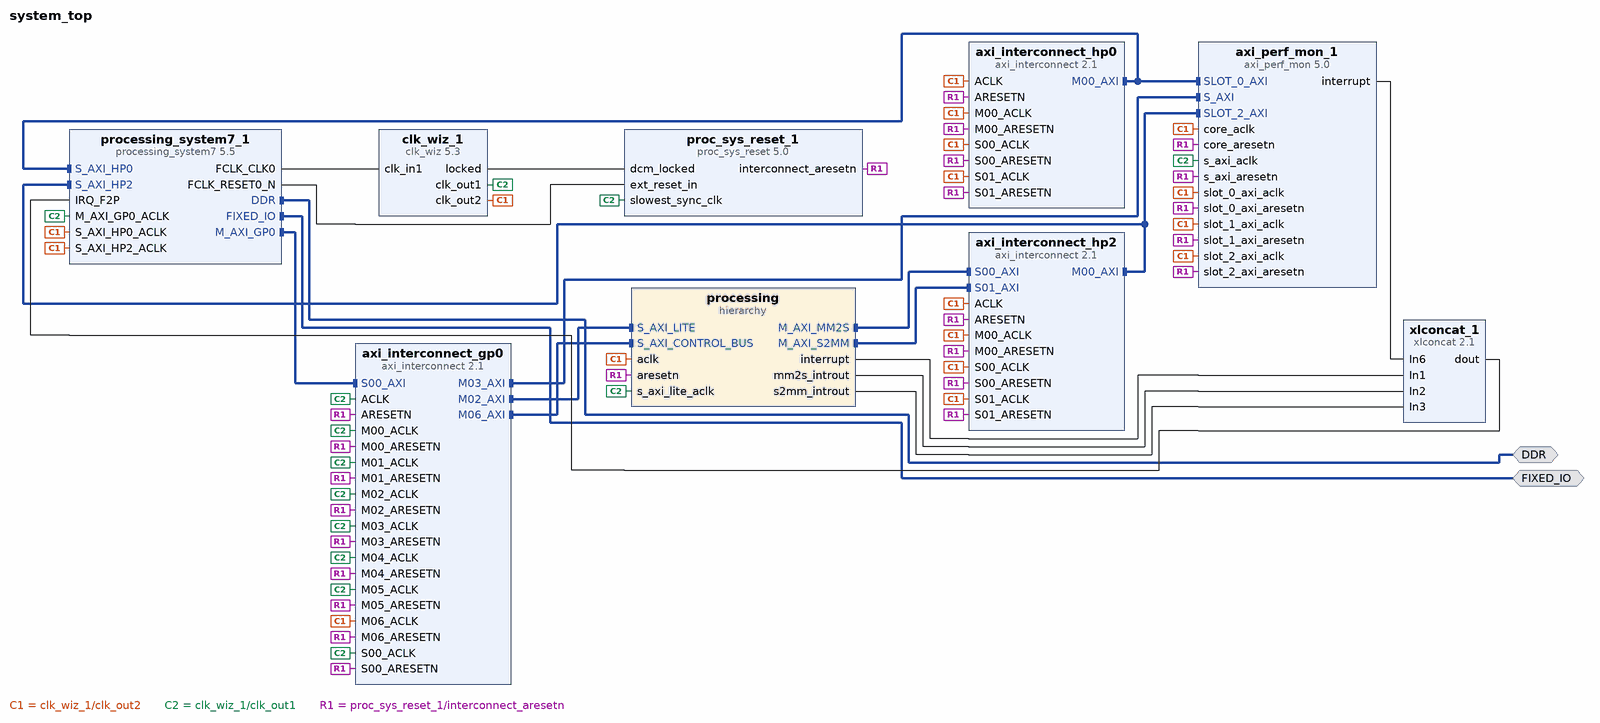
[diagram p0: block diagram of the top level]
# Vivado block design system_top, xc7z020clg484-1, Vivado 2016.3
create_bd_design system_top

create_bd_intf_port -mode Master -vlnv xilinx.com:interface:ddrx_rtl:1.0 DDR
create_bd_intf_port -mode Master -vlnv xilinx.com:display_processing_system7:fixedio_rtl:1.0 FIXED_IO

create_bd_cell -type ip -vlnv xilinx.com:ip:axi_interconnect:2.1 axi_interconnect_gp0
set_property -dict {CONFIG.NUM_MI 7 CONFIG.M06_HAS_REGSLICE 1} [get_bd_cells axi_interconnect_gp0]
create_bd_cell -type ip -vlnv xilinx.com:ip:axi_interconnect:2.1 axi_interconnect_hp0
set_property -dict [list \
  CONFIG.NUM_SI 2 \
  CONFIG.NUM_MI 1 \
  CONFIG.STRATEGY 2 \
  CONFIG.ENABLE_ADVANCED_OPTIONS 1 \
  CONFIG.M00_HAS_REGSLICE 1 \
  CONFIG.M00_HAS_DATA_FIFO 2 \
  CONFIG.S00_HAS_REGSLICE 1 \
  CONFIG.S01_HAS_REGSLICE 1 \
] [get_bd_cells axi_interconnect_hp0]
create_bd_cell -type ip -vlnv xilinx.com:ip:axi_interconnect:2.1 axi_interconnect_hp2
set_property -dict [list \
  CONFIG.NUM_SI 2 \
  CONFIG.NUM_MI 1 \
  CONFIG.STRATEGY 2 \
  CONFIG.ENABLE_ADVANCED_OPTIONS 1 \
  CONFIG.ENABLE_PROTOCOL_CHECKERS 0 \
  CONFIG.XBAR_DATA_WIDTH 64 \
  CONFIG.M00_HAS_REGSLICE 1 \
  CONFIG.M00_HAS_DATA_FIFO 2 \
  CONFIG.S00_HAS_REGSLICE 1 \
  CONFIG.S01_HAS_REGSLICE 1 \
] [get_bd_cells axi_interconnect_hp2]
create_bd_cell -type ip -vlnv xilinx.com:ip:axi_perf_mon:5.0 axi_perf_mon_1
set_property -dict [list \
  CONFIG.C_SLOT_3_AXI_PROTOCOL AXI3 \
  CONFIG.C_SLOT_2_AXI_PROTOCOL AXI3 \
  CONFIG.C_SLOT_1_AXI_PROTOCOL AXI3 \
  CONFIG.C_SLOT_0_AXI_PROTOCOL AXI3 \
  CONFIG.C_NUM_OF_COUNTERS 4 \
  CONFIG.C_NUM_MONITOR_SLOTS 3 \
  CONFIG.ENABLE_EXT_TRIGGERS 0 \
  CONFIG.C_ENABLE_PROFILE 1 \
] [get_bd_cells axi_perf_mon_1]
create_bd_cell -type ip -vlnv xilinx.com:ip:clk_wiz:5.3 clk_wiz_1
set_property -dict [list \
  CONFIG.USE_INCLK_SWITCHOVER false \
  CONFIG.CLKOUT2_USED true \
  CONFIG.NUM_OUT_CLKS 2 \
  CONFIG.CLKOUT1_REQUESTED_OUT_FREQ 50.000 \
  CONFIG.CLKOUT2_REQUESTED_OUT_FREQ 150.000 \
  CONFIG.PRIM_SOURCE No_buffer \
  CONFIG.USE_RESET false \
  CONFIG.CLKOUT1_JITTER 145.943 \
  CONFIG.CLKOUT1_PHASE_ERROR 94.994 \
  CONFIG.CLKOUT2_JITTER 116.798 \
  CONFIG.CLKOUT2_PHASE_ERROR 94.994 \
] [get_bd_cells clk_wiz_1]
create_bd_cell -type ip -vlnv xilinx.com:ip:proc_sys_reset:5.0 proc_sys_reset_1
set_property -dict {CONFIG.C_AUX_RESET_HIGH 0} [get_bd_cells proc_sys_reset_1]
create_bd_cell -type hier processing
create_bd_cell -type ip -vlnv xilinx.com:ip:processing_system7:5.5 processing_system7_1
set_property -dict [list \
  CONFIG.PCW_UIPARAM_DDR_FREQ_MHZ 533.333333 \
  CONFIG.PCW_APU_PERIPHERAL_FREQMHZ 666.666666 \
  CONFIG.PCW_SDIO_PERIPHERAL_FREQMHZ 50 \
  CONFIG.PCW_UART_PERIPHERAL_FREQMHZ 50 \
  CONFIG.PCW_I2C_PERIPHERAL_FREQMHZ 111.111115 \
  CONFIG.PCW_FPGA0_PERIPHERAL_FREQMHZ 100 \
  CONFIG.PCW_FPGA1_PERIPHERAL_FREQMHZ 50 \
  CONFIG.PCW_USE_S_AXI_HP0 1 \
  CONFIG.PCW_USE_S_AXI_HP2 1 \
  CONFIG.PCW_M_AXI_GP0_FREQMHZ 50 \
  CONFIG.PCW_S_AXI_HP0_FREQMHZ 150 \
  CONFIG.PCW_S_AXI_HP2_FREQMHZ 150 \
  CONFIG.PCW_USE_FABRIC_INTERRUPT 1 \
  CONFIG.PCW_GPIO_EMIO_GPIO_WIDTH 2 \
  CONFIG.PCW_IRQ_F2P_INTR 1 \
  CONFIG.PCW_IRQ_F2P_MODE REVERSE \
  CONFIG.PCW_PERIPHERAL_BOARD_PRESET part0 \
  CONFIG.PCW_PRESET_BANK0_VOLTAGE {LVCMOS 1.8V} \
  CONFIG.PCW_PRESET_BANK1_VOLTAGE {LVCMOS 1.8V} \
  CONFIG.PCW_UIPARAM_DDR_PARTNO {MT41J256M8 HX-15E} \
  CONFIG.PCW_QSPI_PERIPHERAL_ENABLE 1 \
  CONFIG.PCW_QSPI_QSPI_IO {MIO 1 .. 6} \
  CONFIG.PCW_QSPI_GRP_SINGLE_SS_ENABLE 1 \
  CONFIG.PCW_QSPI_GRP_SINGLE_SS_IO {MIO 1 .. 6} \
  CONFIG.PCW_QSPI_GRP_FBCLK_ENABLE 1 \
  CONFIG.PCW_QSPI_GRP_FBCLK_IO {MIO 8} \
  CONFIG.PCW_ENET0_PERIPHERAL_ENABLE 1 \
  CONFIG.PCW_ENET0_ENET0_IO {MIO 16 .. 27} \
  CONFIG.PCW_ENET0_GRP_MDIO_ENABLE 1 \
  CONFIG.PCW_ENET0_GRP_MDIO_IO {MIO 52 .. 53} \
  CONFIG.PCW_ENET_RESET_ENABLE 1 \
  CONFIG.PCW_ENET_RESET_SELECT {Share reset pin} \
  CONFIG.PCW_ENET0_RESET_ENABLE 1 \
  CONFIG.PCW_ENET0_RESET_IO {MIO 11} \
  CONFIG.PCW_SD0_PERIPHERAL_ENABLE 1 \
  CONFIG.PCW_SD0_SD0_IO {MIO 40 .. 45} \
  CONFIG.PCW_SD0_GRP_CD_ENABLE 1 \
  CONFIG.PCW_SD0_GRP_CD_IO {MIO 0} \
  CONFIG.PCW_SD0_GRP_WP_ENABLE 1 \
  CONFIG.PCW_SD0_GRP_WP_IO {MIO 15} \
  CONFIG.PCW_UART1_PERIPHERAL_ENABLE 1 \
  CONFIG.PCW_UART1_UART1_IO {MIO 48 .. 49} \
  CONFIG.PCW_TRACE_INTERNAL_WIDTH 32 \
  CONFIG.PCW_USB0_PERIPHERAL_ENABLE 1 \
  CONFIG.PCW_USB0_USB0_IO {MIO 28 .. 39} \
  CONFIG.PCW_USB_RESET_ENABLE 1 \
  CONFIG.PCW_USB_RESET_SELECT {Share reset pin} \
  CONFIG.PCW_USB0_RESET_ENABLE 1 \
  CONFIG.PCW_USB0_RESET_IO {MIO 7} \
  CONFIG.PCW_I2C0_PERIPHERAL_ENABLE 1 \
  CONFIG.PCW_I2C0_I2C0_IO {MIO 50 .. 51} \
  CONFIG.PCW_I2C0_GRP_INT_ENABLE 0 \
  CONFIG.PCW_I2C0_RESET_ENABLE 1 \
  CONFIG.PCW_I2C0_RESET_IO {MIO 13} \
  CONFIG.PCW_I2C1_PERIPHERAL_ENABLE 1 \
  CONFIG.PCW_I2C1_I2C1_IO EMIO \
  CONFIG.PCW_I2C_RESET_ENABLE 1 \
  CONFIG.PCW_I2C_RESET_SELECT {Share reset pin} \
  CONFIG.PCW_GPIO_MIO_GPIO_ENABLE 1 \
  CONFIG.PCW_GPIO_MIO_GPIO_IO MIO \
  CONFIG.PCW_GPIO_EMIO_GPIO_ENABLE 1 \
  CONFIG.PCW_GPIO_EMIO_GPIO_IO 2 \
  CONFIG.PCW_ENET0_PERIPHERAL_FREQMHZ {100 Mbps} \
  CONFIG.PCW_DCI_PERIPHERAL_CLKSRC 1 \
  CONFIG.PCW_PCAP_PERIPHERAL_CLKSRC 1 \
  CONFIG.preset ZC702 \
] [get_bd_cells processing_system7_1]
# 353 more settings of processing_system7_1 are not shown: defaults, MIO pin electricals, DDR timing, and values the tool derives
create_bd_cell -type ip -vlnv xilinx.com:ip:xlconcat:2.1 xlconcat_1
set_property -dict {CONFIG.NUM_PORTS 7} [get_bd_cells xlconcat_1]

# ---- hierarchy /processing ----
current_bd_instance /processing
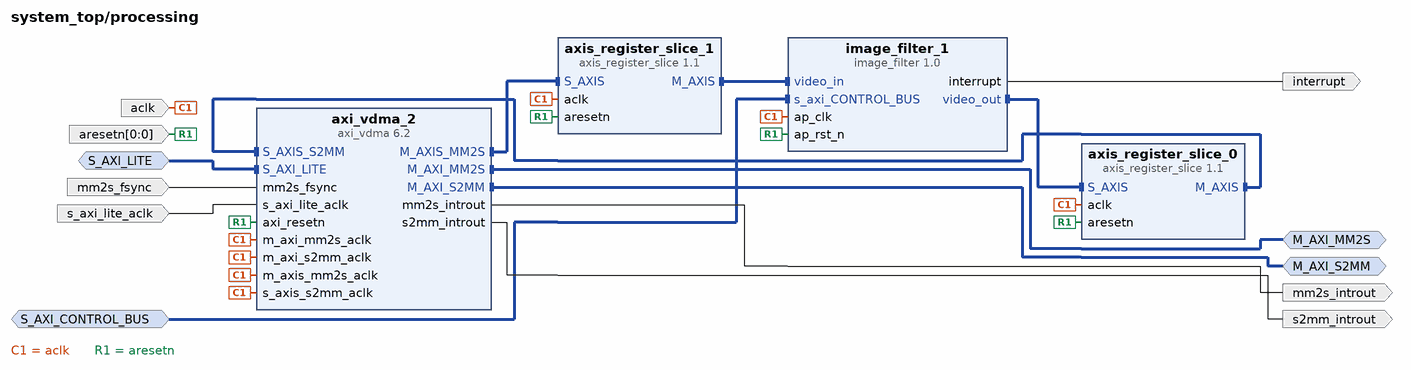
[diagram p1: block diagram inside /processing]
create_bd_intf_pin -mode Master -vlnv xilinx.com:interface:aximm_rtl:1.0 M_AXI_MM2S
create_bd_intf_pin -mode Master -vlnv xilinx.com:interface:aximm_rtl:1.0 M_AXI_S2MM
create_bd_intf_pin -mode Slave -vlnv xilinx.com:interface:aximm_rtl:1.0 S_AXI_CONTROL_BUS
create_bd_intf_pin -mode Slave -vlnv xilinx.com:interface:aximm_rtl:1.0 S_AXI_LITE
create_bd_pin -dir I -type clk aclk
create_bd_pin -dir I -from 0 -to 0 -type rst aresetn
create_bd_pin -dir O -type intr interrupt
create_bd_pin -dir I mm2s_fsync
create_bd_pin -dir O -type intr mm2s_introut
create_bd_pin -dir O -type intr s2mm_introut
create_bd_pin -dir I -type clk s_axi_lite_aclk

create_bd_cell -type ip -vlnv xilinx.com:ip:axi_vdma:6.2 axi_vdma_2
set_property -dict [list \
  CONFIG.c_m_axi_mm2s_data_width 32 \
  CONFIG.c_m_axis_mm2s_tdata_width 16 \
  CONFIG.c_m_axi_s2mm_data_width 32 \
  CONFIG.c_num_fstores 1 \
  CONFIG.c_use_mm2s_fsync 1 \
  CONFIG.c_use_s2mm_fsync 2 \
  CONFIG.c_mm2s_genlock_mode 3 \
  CONFIG.c_s2mm_genlock_mode 2 \
  CONFIG.c_mm2s_linebuffer_depth 4096 \
  CONFIG.c_s2mm_linebuffer_depth 4096 \
  CONFIG.c_mm2s_max_burst_length 16 \
  CONFIG.c_s2mm_max_burst_length 16 \
  CONFIG.c_enable_debug_info_7 1 \
  CONFIG.c_enable_debug_info_15 1 \
] [get_bd_cells axi_vdma_2]
create_bd_cell -type ip -vlnv xilinx.com:ip:axis_register_slice:1.1 axis_register_slice_0
create_bd_cell -type ip -vlnv xilinx.com:ip:axis_register_slice:1.1 axis_register_slice_1
create_bd_cell -type ip -vlnv xilinx.com:hls:image_filter:1.0 image_filter_1

# ---- connections ----

current_bd_instance /processing
connect_bd_intf_net [get_bd_intf_pins axi_vdma_2/M_AXIS_MM2S] [get_bd_intf_pins axis_register_slice_1/S_AXIS]
connect_bd_intf_net [get_bd_intf_pins axi_vdma_2/S_AXIS_S2MM] [get_bd_intf_pins axis_register_slice_0/M_AXIS]
connect_bd_intf_net [get_bd_intf_pins axis_register_slice_1/M_AXIS] [get_bd_intf_pins image_filter_1/video_in]
connect_bd_intf_net -intf_net image_filter_1_OUTPUT_STREAM [get_bd_intf_pins axis_register_slice_0/S_AXIS] [get_bd_intf_pins image_filter_1/video_out]
connect_bd_intf_net [get_bd_intf_pins M_AXI_MM2S] [get_bd_intf_pins axi_vdma_2/M_AXI_MM2S]
connect_bd_intf_net [get_bd_intf_pins M_AXI_S2MM] [get_bd_intf_pins axi_vdma_2/M_AXI_S2MM]
connect_bd_intf_net -intf_net axi_interconnect_gp0_M06_AXI [get_bd_intf_pins S_AXI_CONTROL_BUS] [get_bd_intf_pins image_filter_1/s_axi_CONTROL_BUS]
connect_bd_intf_net [get_bd_intf_pins S_AXI_LITE] [get_bd_intf_pins axi_vdma_2/S_AXI_LITE]
connect_bd_net [get_bd_pins axi_vdma_2/mm2s_introut] [get_bd_pins mm2s_introut]
connect_bd_net [get_bd_pins axi_vdma_2/s2mm_introut] [get_bd_pins s2mm_introut]
connect_bd_net -net clk_150mhz [get_bd_pins aclk] \
  [get_bd_pins axi_vdma_2/m_axi_mm2s_aclk] [get_bd_pins axi_vdma_2/m_axi_s2mm_aclk] [get_bd_pins axi_vdma_2/m_axis_mm2s_aclk] \
  [get_bd_pins axi_vdma_2/s_axis_s2mm_aclk] [get_bd_pins axis_register_slice_0/aclk] [get_bd_pins axis_register_slice_1/aclk] \
  [get_bd_pins image_filter_1/ap_clk]
connect_bd_net -net filter_int_1 [get_bd_pins image_filter_1/interrupt] [get_bd_pins interrupt]
connect_bd_net [get_bd_pins mm2s_fsync] [get_bd_pins axi_vdma_2/mm2s_fsync]
connect_bd_net -net proc_sys_reset_1_interconnect_aresetn [get_bd_pins aresetn] \
  [get_bd_pins axi_vdma_2/axi_resetn] [get_bd_pins axis_register_slice_0/aresetn] [get_bd_pins axis_register_slice_1/aresetn] \
  [get_bd_pins image_filter_1/ap_rst_n]
connect_bd_net [get_bd_pins s_axi_lite_aclk] [get_bd_pins axi_vdma_2/s_axi_lite_aclk]

current_bd_instance /
connect_bd_intf_net -intf_net S00_AXI1_1 [get_bd_intf_pins axi_interconnect_hp2/S00_AXI] [get_bd_intf_pins processing/M_AXI_MM2S]
connect_bd_intf_net -intf_net S01_AXI1_1 [get_bd_intf_pins axi_interconnect_hp2/S01_AXI] [get_bd_intf_pins processing/M_AXI_S2MM]
connect_bd_intf_net -intf_net axi_interconnect_1_m00_axi [get_bd_intf_pins axi_interconnect_hp0/M00_AXI] [get_bd_intf_pins processing_system7_1/S_AXI_HP0]
connect_bd_intf_net [get_bd_intf_pins axi_interconnect_hp0/M00_AXI] [get_bd_intf_pins axi_perf_mon_1/SLOT_0_AXI]
connect_bd_intf_net -intf_net axi_interconnect_3_m00_axi [get_bd_intf_pins axi_interconnect_hp2/M00_AXI] [get_bd_intf_pins processing_system7_1/S_AXI_HP2]
connect_bd_intf_net [get_bd_intf_pins axi_interconnect_hp2/M00_AXI] [get_bd_intf_pins axi_perf_mon_1/SLOT_2_AXI]
connect_bd_intf_net [get_bd_intf_pins axi_interconnect_gp0/M02_AXI] [get_bd_intf_pins processing/S_AXI_LITE]
connect_bd_intf_net [get_bd_intf_pins axi_interconnect_gp0/M03_AXI] [get_bd_intf_pins axi_perf_mon_1/S_AXI]
connect_bd_intf_net [get_bd_intf_pins axi_interconnect_gp0/M06_AXI] [get_bd_intf_pins processing/S_AXI_CONTROL_BUS]
connect_bd_intf_net [get_bd_intf_pins axi_interconnect_gp0/S00_AXI] [get_bd_intf_pins processing_system7_1/M_AXI_GP0]
connect_bd_intf_net [get_bd_intf_ports DDR] [get_bd_intf_pins processing_system7_1/DDR]
connect_bd_intf_net [get_bd_intf_ports FIXED_IO] [get_bd_intf_pins processing_system7_1/FIXED_IO]
connect_bd_net [get_bd_pins axi_perf_mon_1/interrupt] [get_bd_pins xlconcat_1/In6]
connect_bd_net -net clk_150mhz [get_bd_pins clk_wiz_1/clk_out2] \
  [get_bd_pins axi_interconnect_gp0/M06_ACLK] [get_bd_pins axi_interconnect_hp0/ACLK] \
  [get_bd_pins axi_interconnect_hp0/M00_ACLK] [get_bd_pins axi_interconnect_hp0/S00_ACLK] \
  [get_bd_pins axi_interconnect_hp0/S01_ACLK] [get_bd_pins axi_interconnect_hp2/ACLK] \
  [get_bd_pins axi_interconnect_hp2/M00_ACLK] [get_bd_pins axi_interconnect_hp2/S00_ACLK] \
  [get_bd_pins axi_interconnect_hp2/S01_ACLK] [get_bd_pins axi_perf_mon_1/core_aclk] \
  [get_bd_pins axi_perf_mon_1/slot_0_axi_aclk] [get_bd_pins axi_perf_mon_1/slot_1_axi_aclk] \
  [get_bd_pins axi_perf_mon_1/slot_2_axi_aclk] [get_bd_pins processing/aclk] \
  [get_bd_pins processing_system7_1/S_AXI_HP0_ACLK] [get_bd_pins processing_system7_1/S_AXI_HP2_ACLK]
connect_bd_net -net clk_50mhz [get_bd_pins clk_wiz_1/clk_out1] \
  [get_bd_pins axi_interconnect_gp0/ACLK] [get_bd_pins axi_interconnect_gp0/M00_ACLK] \
  [get_bd_pins axi_interconnect_gp0/M01_ACLK] [get_bd_pins axi_interconnect_gp0/M02_ACLK] \
  [get_bd_pins axi_interconnect_gp0/M03_ACLK] [get_bd_pins axi_interconnect_gp0/M04_ACLK] \
  [get_bd_pins axi_interconnect_gp0/M05_ACLK] [get_bd_pins axi_interconnect_gp0/S00_ACLK] \
  [get_bd_pins axi_perf_mon_1/s_axi_aclk] [get_bd_pins proc_sys_reset_1/slowest_sync_clk] \
  [get_bd_pins processing/s_axi_lite_aclk] [get_bd_pins processing_system7_1/M_AXI_GP0_ACLK]
connect_bd_net [get_bd_pins clk_wiz_1/locked] [get_bd_pins proc_sys_reset_1/dcm_locked]
connect_bd_net -net filter_int_1 [get_bd_pins processing/interrupt] [get_bd_pins xlconcat_1/In1]
connect_bd_net [get_bd_pins proc_sys_reset_1/interconnect_aresetn] \
  [get_bd_pins axi_interconnect_gp0/ARESETN] [get_bd_pins axi_interconnect_gp0/M00_ARESETN] \
  [get_bd_pins axi_interconnect_gp0/M01_ARESETN] [get_bd_pins axi_interconnect_gp0/M02_ARESETN] \
  [get_bd_pins axi_interconnect_gp0/M03_ARESETN] [get_bd_pins axi_interconnect_gp0/M04_ARESETN] \
  [get_bd_pins axi_interconnect_gp0/M05_ARESETN] [get_bd_pins axi_interconnect_gp0/M06_ARESETN] \
  [get_bd_pins axi_interconnect_gp0/S00_ARESETN] [get_bd_pins axi_interconnect_hp0/ARESETN] \
  [get_bd_pins axi_interconnect_hp0/M00_ARESETN] [get_bd_pins axi_interconnect_hp0/S00_ARESETN] \
  [get_bd_pins axi_interconnect_hp0/S01_ARESETN] [get_bd_pins axi_interconnect_hp2/ARESETN] \
  [get_bd_pins axi_interconnect_hp2/M00_ARESETN] [get_bd_pins axi_interconnect_hp2/S00_ARESETN] \
  [get_bd_pins axi_interconnect_hp2/S01_ARESETN] [get_bd_pins axi_perf_mon_1/core_aresetn] \
  [get_bd_pins axi_perf_mon_1/s_axi_aresetn] [get_bd_pins axi_perf_mon_1/slot_0_axi_aresetn] \
  [get_bd_pins axi_perf_mon_1/slot_1_axi_aresetn] [get_bd_pins axi_perf_mon_1/slot_2_axi_aresetn] \
  [get_bd_pins processing/aresetn]
connect_bd_net [get_bd_pins processing/mm2s_introut] [get_bd_pins xlconcat_1/In2]
connect_bd_net [get_bd_pins processing/s2mm_introut] [get_bd_pins xlconcat_1/In3]
connect_bd_net [get_bd_pins processing_system7_1/FCLK_CLK0] [get_bd_pins clk_wiz_1/clk_in1]
connect_bd_net [get_bd_pins processing_system7_1/FCLK_RESET0_N] [get_bd_pins proc_sys_reset_1/ext_reset_in]
connect_bd_net -net xlconcat_3_dout [get_bd_pins xlconcat_1/dout] [get_bd_pins processing_system7_1/IRQ_F2P]

# ---- address map ----
assign_bd_address -offset 0x00000000 -range 1G -target_address_space [get_bd_addr_spaces processing/axi_vdma_2/Data_MM2S] [get_bd_addr_segs processing_system7_1/S_AXI_HP2/HP2_DDR_LOWOCM]
assign_bd_address -offset 0x00000000 -range 1G -target_address_space [get_bd_addr_spaces processing/axi_vdma_2/Data_S2MM] [get_bd_addr_segs processing_system7_1/S_AXI_HP2/HP2_DDR_LOWOCM]
assign_bd_address -offset 0x400B0000 -range 64K -target_address_space [get_bd_addr_spaces processing_system7_1/Data] [get_bd_addr_segs processing/axi_vdma_2/S_AXI_LITE/Reg]
assign_bd_address -offset 0x400D0000 -range 64K -target_address_space [get_bd_addr_spaces processing_system7_1/Data] [get_bd_addr_segs processing/image_filter_1/s_axi_CONTROL_BUS/Reg]
assign_bd_address -offset 0x400F0000 -range 64K -target_address_space [get_bd_addr_spaces processing_system7_1/Data] [get_bd_addr_segs axi_perf_mon_1/S_AXI/Reg]

validate_bd_design
save_bd_design
